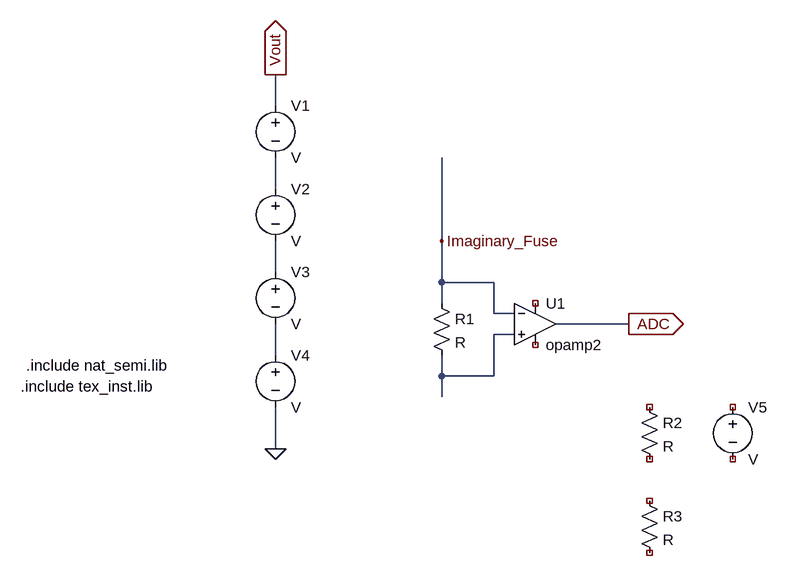
[diagram p0: schematic Draft.asc]
Draft.asc, the LTspice schematic file:
Version 4.1
SHEET 1 904 696
WIRE 144 -32 144 -80
WIRE 144 96 144 48
WIRE 400 176 400 48
WIRE 144 224 144 176
WIRE 400 240 400 176
WIRE 480 240 400 240
WIRE 400 272 400 240
WIRE 480 288 480 240
WIRE 512 288 480 288
WIRE 688 304 576 304
WIRE 512 320 480 320
WIRE 144 352 144 304
WIRE 400 384 400 352
WIRE 480 384 480 320
WIRE 480 384 400 384
WIRE 400 416 400 384
WIRE 144 496 144 432
FLAG 144 496 0
FLAG 144 -80 Vout
IOPIN 144 -80 Out
FLAG 400 176 Imaginary_Fuse
FLAG 688 304 ADC
IOPIN 688 304 Out
SYMBOL voltage 144 -48 R0
SYMATTR InstName V1
SYMBOL voltage 144 80 R0
SYMATTR InstName V2
SYMBOL voltage 144 208 R0
SYMATTR InstName V3
SYMBOL voltage 144 336 R0
SYMATTR InstName V4
SYMBOL res 384 256 R0
SYMATTR InstName R1
SYMBOL OpAmps\\opamp2 544 240 R0
SYMATTR InstName U1
SYMBOL voltage 848 416 R0
SYMATTR InstName V5
SYMBOL res 704 416 R0
SYMATTR InstName R2
SYMBOL res 704 560 R0
SYMATTR InstName R3
TEXT -240 368 Left 2 !.include nat_semi.lib
TEXT -248 400 Left 2 !.include tex_inst.lib

The netlist it stands for:
* Draft.asc
V1 Vout N001 V
V2 N001 N002 V
V3 N002 N004 V
V4 N004 0 V
R1 Imaginary_Fuse N003 R
X§U1 N003 Imaginary_Fuse NC_01 NC_02 ADC opamp2  ; pins In+ In- V+ V- OUT
V5 NC_03 NC_04 V
R2 NC_05 NC_06 R
R3 NC_07 NC_08 R
.include nat_semi.lib
.include tex_inst.lib
.backanno
.end